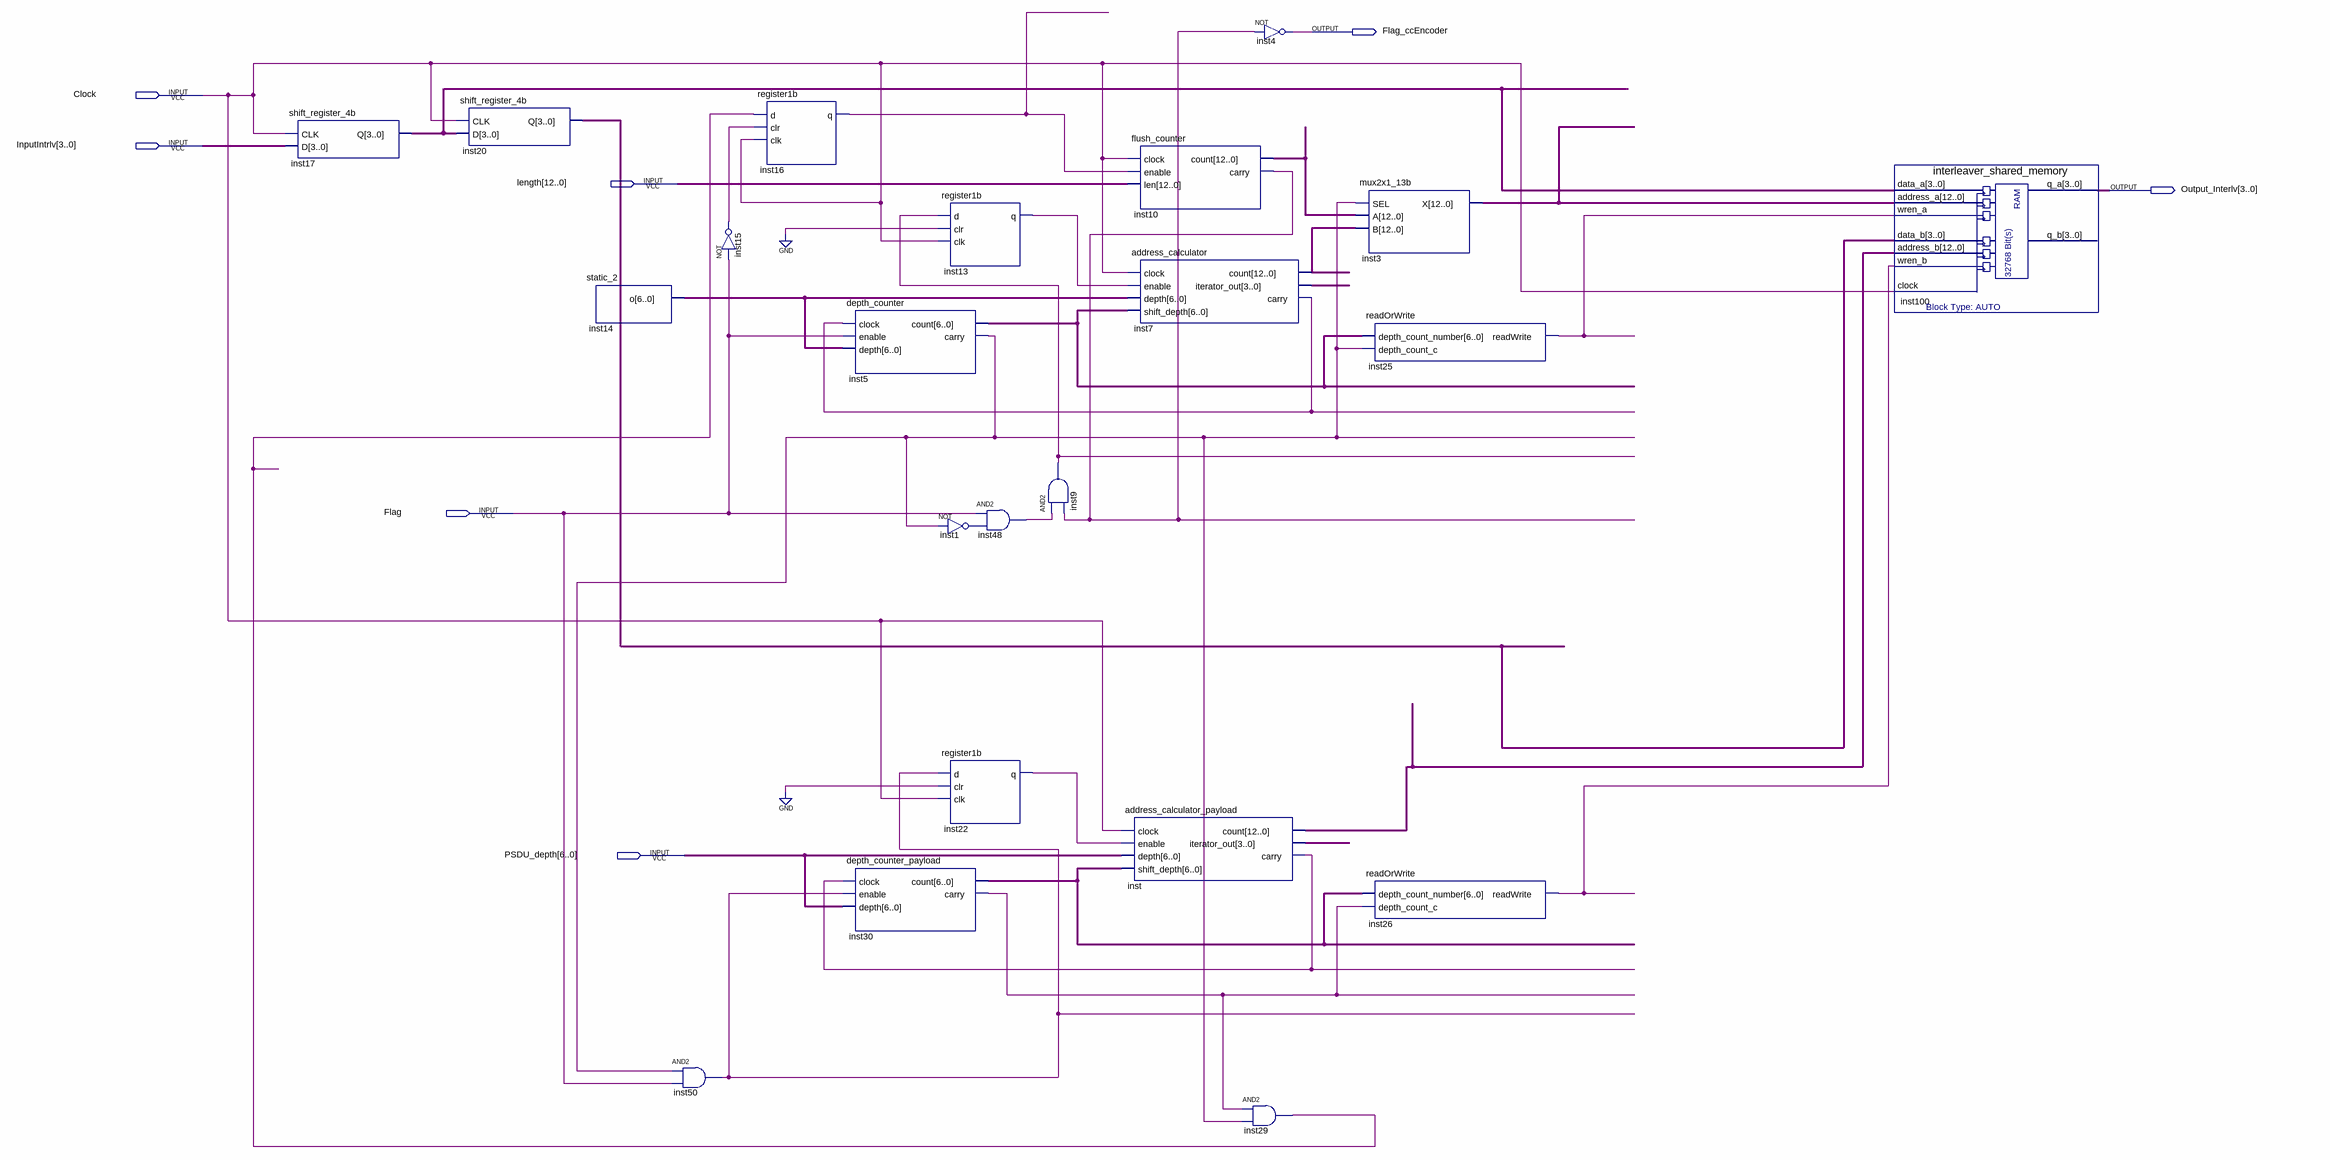
[diagram p0: schematic sheet]
// Quartus schematic Interleaver.bdf as structural Verilog: 22 symbols, 7 pins
module Interleaver (
  input  Clock,
  input  [3:0] InputIntrlv,
  input  [12:0] length,
  input  Flag,
  input  [6:0] PSDU_depth,
  output Flag_ccEncoder,
  output [3:0] Output_Interlv
);

  wire inst1_out, inst5_carry, inst7_carry, inst9_out, inst10_carry, inst13_q, inst15_out, inst16_q,
       inst22_q, inst25_readwrite, inst26_readwrite, inst29_out, inst30_carry, inst48_out, inst50_out,
       inst_carry;
  wire [3:0] inst7_iterator_out, inst17_q, inst20_q, inst_iterator_out;
  wire [6:0] inst5_count, inst14_o, inst30_count;
  wire [12:0] inst3_x, inst7_count, inst10_count, inst_count;

  shift_register_4b inst17 (.CLK(Clock), .D(InputIntrlv), .Q(inst17_q));
  shift_register_4b inst20 (.CLK(Clock), .D(inst17_q), .Q(inst20_q));
  static_2 inst14 (.o(inst14_o));
  and inst50 (inst50_out, inst5_carry, Flag);
  not inst15 (inst15_out, Flag);
  register1b inst16 (.d(inst29_out), .clr(inst15_out), .clk(Clock), .q(inst16_q));
  depth_counter inst5 (.clock(inst7_carry), .enable(Flag), .depth(inst14_o), .count(inst5_count), .carry(inst5_carry));
  depth_counter_payload inst30 (
    .clock(inst_carry), .enable(inst50_out), .depth(PSDU_depth), .count(inst30_count), .carry(inst30_carry));
  register1b inst13 (.d(inst9_out), .clr(1'b0), .clk(Clock), .q(inst13_q));
  not inst1 (inst1_out, inst5_carry);
  register1b inst22 (.d(inst50_out), .clr(1'b0), .clk(Clock), .q(inst22_q));
  and inst48 (inst48_out, Flag, inst1_out);
  and inst9 (inst9_out, inst48_out, inst10_carry);
  flush_counter inst10 (.clock(Clock), .enable(inst16_q), .len(length), .count(inst10_count), .carry(inst10_carry));
  address_calculator inst7 (
    .clock(Clock), .enable(inst13_q), .depth(inst14_o), .shift_depth(inst5_count), .count(inst7_count),
    .iterator_out(inst7_iterator_out), .carry(inst7_carry));
  address_calculator_payload inst (
    .clock(Clock), .enable(inst22_q), .depth(PSDU_depth), .shift_depth(inst30_count), .count(inst_count),
    .iterator_out(inst_iterator_out), .carry(inst_carry));
  not inst4 (Flag_ccEncoder, inst10_carry);
  and inst29 (inst29_out, inst30_carry, inst5_carry);
  mux2x1_13b inst3 (.SEL(inst5_carry), .A(inst10_count), .B(inst7_count), .X(inst3_x));
  readOrWrite inst25 (.depth_count_number(inst5_count), .depth_count_c(inst5_carry), .readWrite(inst25_readwrite));
  readOrWrite inst26 (.depth_count_number(inst30_count), .depth_count_c(inst30_carry), .readWrite(inst26_readwrite));
  interleaver_shared_memory inst100 (
    .data_a(inst17_q), .address_a(inst3_x), .wren_a(inst25_readwrite), .data_b(inst20_q),
    .address_b(inst_count), .wren_b(inst26_readwrite), .clock(Clock), .q_a(Output_Interlv));  // open: q_b
endmodule
